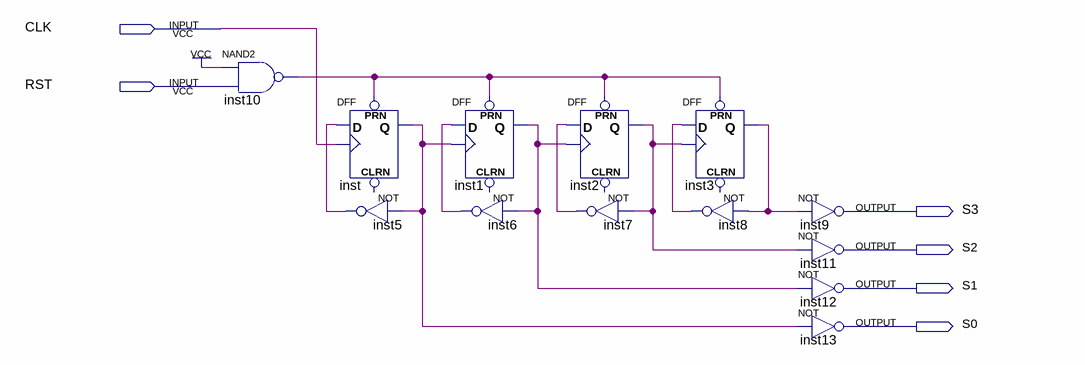
[diagram p0: schematic sheet]
// Quartus schematic 4BIT-UPCOUNTER.bdf as structural Verilog: 13 symbols, 6 pins
module \4BIT-UPCOUNTER  (
  input  CLK,
  input  RST,
  output S3,
  output S2,
  output S1,
  output S0
);

  wire inst1_q, inst2_q, inst3_q, inst5_out, inst6_out, inst7_out, inst8_out, inst10_out, inst_q;

  nand inst10 (inst10_out, 1'b1, RST);
  DFF inst (.CLK(CLK), .D(inst5_out), .PRN(inst10_out), .Q(inst_q));  // open: CLRN
  not inst5 (inst5_out, inst_q);
  DFF inst1 (.CLK(inst_q), .D(inst6_out), .PRN(inst10_out), .Q(inst1_q));  // open: CLRN
  not inst6 (inst6_out, inst1_q);
  DFF inst2 (.CLK(inst1_q), .D(inst7_out), .PRN(inst10_out), .Q(inst2_q));  // open: CLRN
  not inst7 (inst7_out, inst2_q);
  DFF inst3 (.CLK(inst2_q), .D(inst8_out), .PRN(inst10_out), .Q(inst3_q));  // open: CLRN
  not inst8 (inst8_out, inst3_q);
  not inst9 (S3, inst3_q);
  not inst11 (S2, inst2_q);
  not inst12 (S1, inst1_q);
  not inst13 (S0, inst_q);
endmodule
